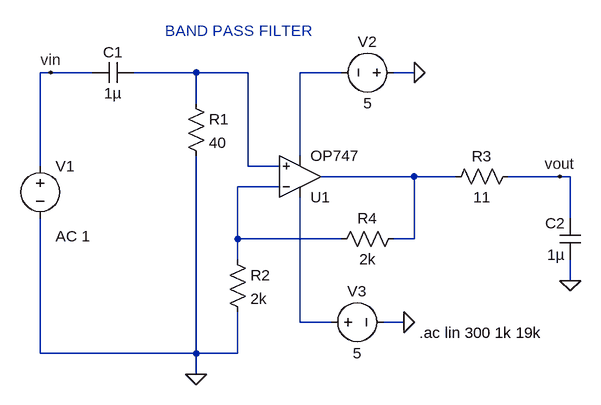
[diagram p0: schematic Band Pass.asc]
Band Pass.asc, the LTspice schematic file:
Version 4
SHEET 1 880 680
WIRE -128 -112 -144 -112
WIRE -64 -112 -128 -112
WIRE 96 -112 0 -112
WIRE 176 -112 96 -112
WIRE 320 -112 256 -112
WIRE 432 -112 400 -112
WIRE 96 -64 96 -112
WIRE 256 16 256 -112
WIRE -144 32 -144 -112
WIRE 176 32 176 -112
WIRE 224 32 176 32
WIRE 432 48 288 48
WIRE 496 48 432 48
WIRE 656 48 576 48
WIRE 672 48 656 48
WIRE 224 64 160 64
WIRE 672 112 672 48
WIRE 160 144 160 64
WIRE 320 144 160 144
WIRE 432 144 432 48
WIRE 432 144 400 144
WIRE 160 176 160 144
WIRE 672 208 672 176
WIRE 256 272 256 80
WIRE 304 272 256 272
WIRE 416 272 384 272
WIRE -144 320 -144 112
WIRE 96 320 96 16
WIRE 96 320 -144 320
WIRE 160 320 160 256
WIRE 160 320 96 320
WIRE 96 352 96 320
FLAG 432 -112 0
FLAG 416 272 0
FLAG 672 208 0
FLAG 96 352 0
FLAG 656 48 vout
FLAG -128 -112 vin
SYMBOL OpAmps\\OP747 256 112 M180
SYMATTR InstName U1
SYMBOL res 80 -80 R0
SYMATTR InstName R1
SYMATTR Value 40
SYMBOL res 144 160 R0
SYMATTR InstName R2
SYMATTR Value 2k
SYMBOL res 592 32 R90
WINDOW 0 0 56 VBottom 2
WINDOW 3 32 56 VTop 2
SYMATTR InstName R3
SYMATTR Value 11
SYMBOL res 416 128 R90
WINDOW 0 0 56 VBottom 2
WINDOW 3 32 56 VTop 2
SYMATTR InstName R4
SYMATTR Value 2k
SYMBOL cap 0 -128 R90
WINDOW 0 0 32 VBottom 2
WINDOW 3 32 32 VTop 2
SYMATTR InstName C1
SYMATTR Value 1µ
SYMBOL cap 688 176 R180
WINDOW 0 24 56 Left 2
WINDOW 3 24 8 Left 2
SYMATTR InstName C2
SYMATTR Value 1µ
SYMBOL voltage -144 16 R0
WINDOW 123 24 124 Left 2
WINDOW 39 0 0 Left 0
SYMATTR InstName V1
SYMATTR Value ""
SYMATTR Value2 AC 1
SYMBOL voltage 416 -112 R90
WINDOW 0 -32 56 VBottom 2
WINDOW 3 32 56 VTop 2
SYMATTR InstName V2
SYMATTR Value 5
SYMBOL voltage 288 272 R270
WINDOW 0 32 56 VTop 2
WINDOW 3 -32 56 VBottom 2
SYMATTR InstName V3
SYMATTR Value 5
TEXT 440 288 Left 2 !.ac lin 300 1k 19k
TEXT 48 -176 Left 2 ;BAND PASS FILTER

The netlist it stands for:
* Band Pass.asc
XU1 N001 N004 N005 N002 N003 OP747  ; pins In+ In- V+ V- OUT
R1 N001 0 40
R2 N004 0 2k
R3 vout N003 11
R4 N003 N004 2k
C1 N001 vin 1µ
C2 0 vout 1µ
V1 vin 0 AC 1
V2 0 N002 5
V3 N005 0 5
.ac lin 300 1k 19k
* BAND PASS FILTER
.backanno
.end